# EAGLE schematic waves_v10 (EAGLE 9.6.2)

## Sheet 1 of 2
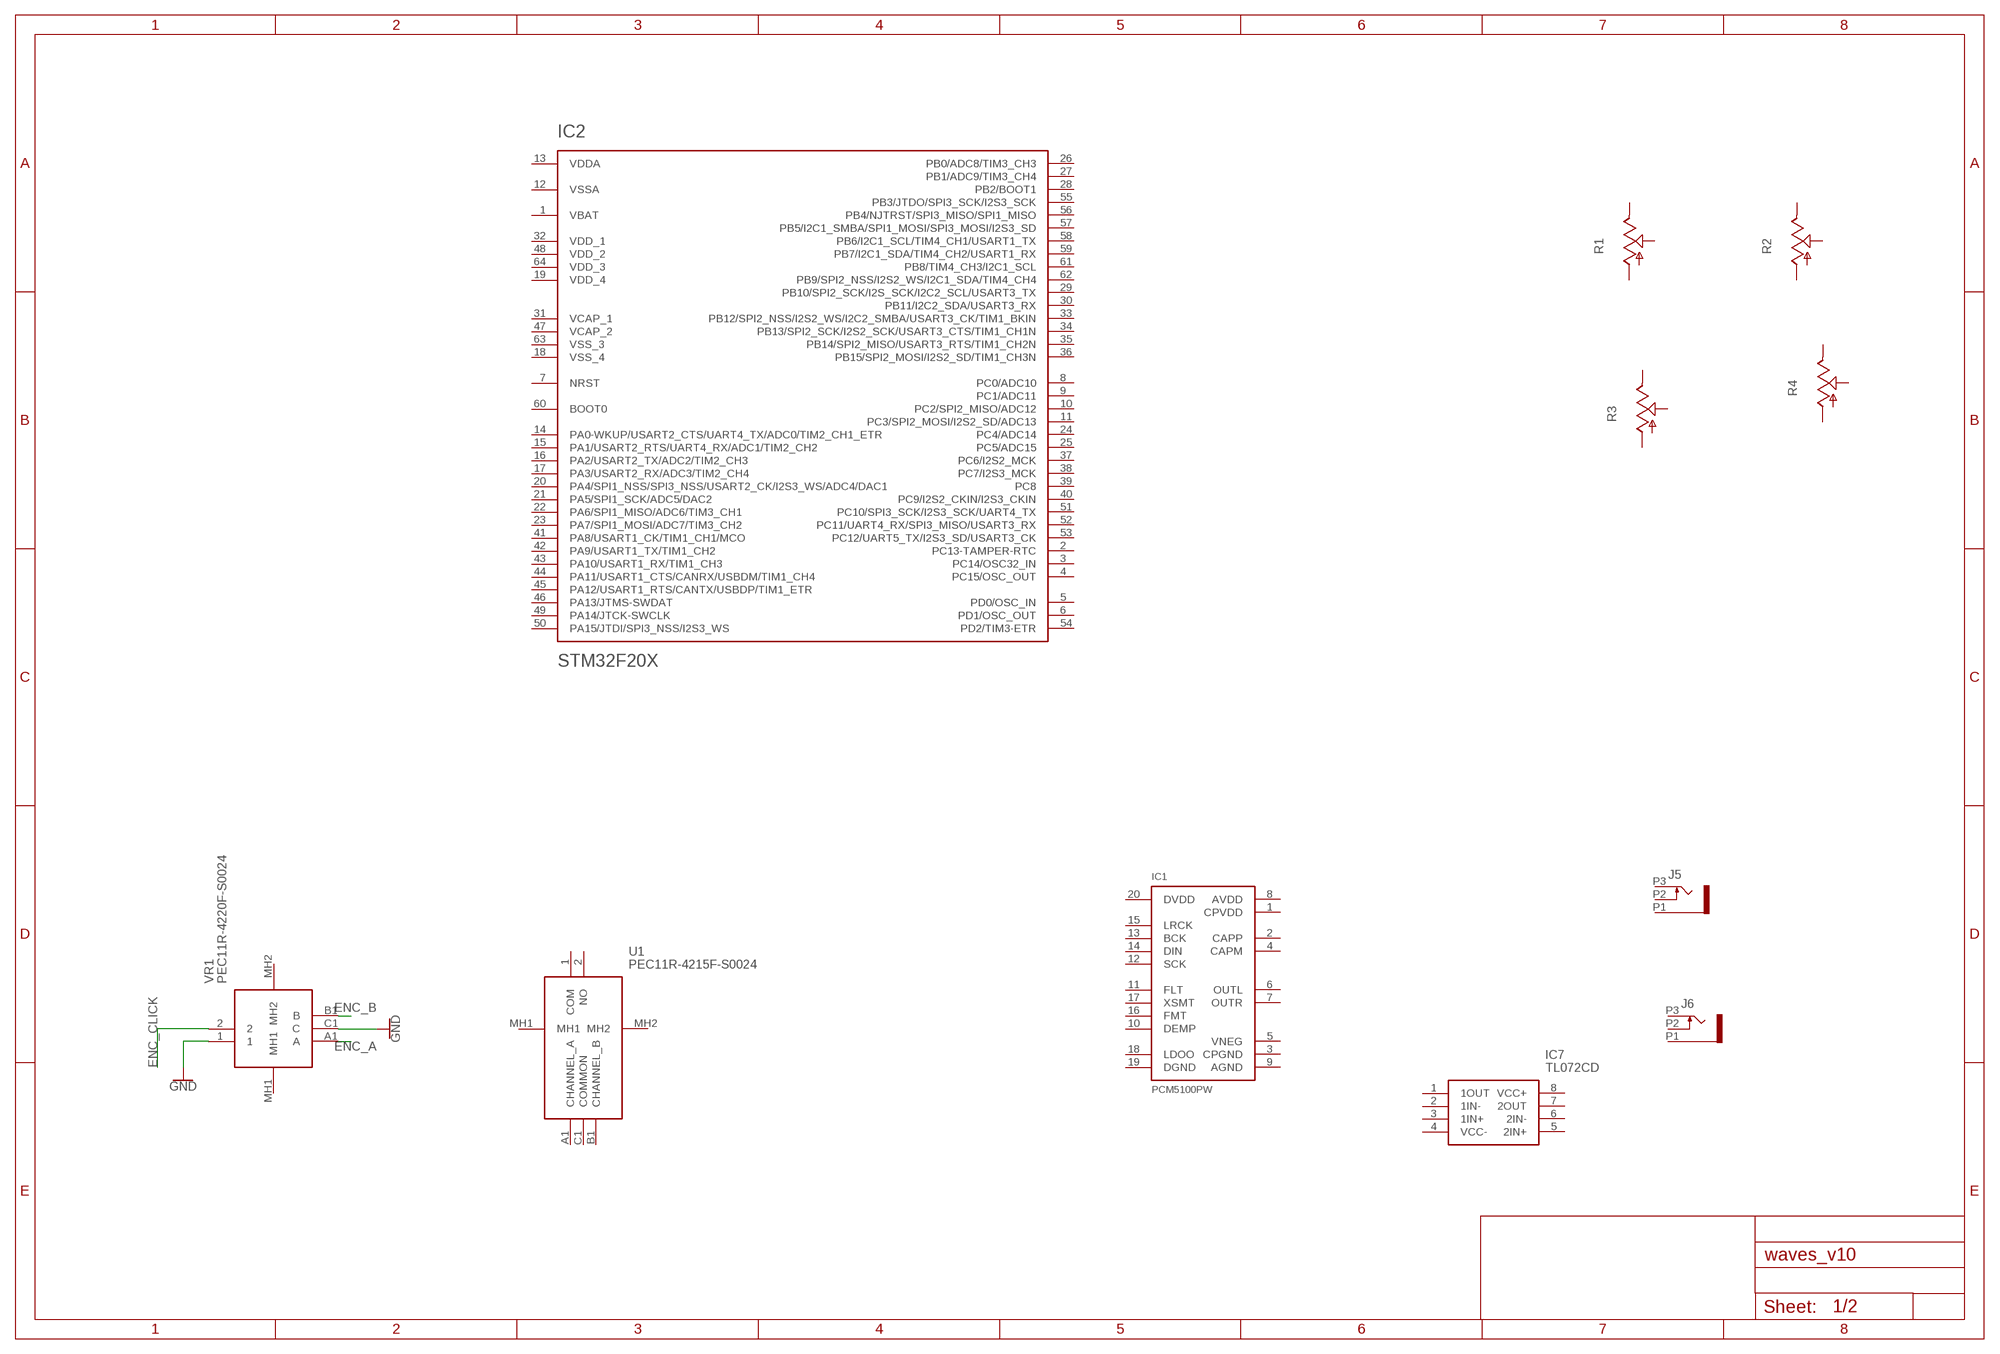
[diagram p0: schematic, sheet 1]

### Parts
IC1  PCM5100PW  [SSOP20]
IC2  STM32F20X  [TQFP-10X10-64]
IC7  TL072CD  [SOIC127P600X175-8N]
J5  PJ301_THONKICONN6  [WQP_PJ_301M6]
J6  PJ301_THONKICONN6  [WQP_PJ_301M6]
R1  POT_USVERTICAL_PS  [ALPS_POT_VERTICAL_PS]
R2  POT_USVERTICAL_PS  [ALPS_POT_VERTICAL_PS]
R3  POT_USVERTICAL_PS  [ALPS_POT_VERTICAL_PS]
R4  POT_USVERTICAL_PS  [ALPS_POT_VERTICAL_PS]
U1  PEC11R-4215F-S0024  [PEC11R4215FS0024]
VR1  PEC11R-4220F-S0024  [PEC11R4220FS0024]

### Nets
ENC_A: VR1.A1(A)
ENC_B: VR1.B1(B)
ENC_CLICK: VR1.2
GND: VR1.1 VR1.C1(C)
Unconnected: IC1.1(CPVDD) IC1.2(CAPP) IC1.3(CPGND) IC1.4(CAPM) IC1.5(VNEG) IC1.6(OUTL) IC1.7(OUTR) IC1.8(AVDD) IC1.9(AGND) IC1.10(DEMP) IC1.11(FLT) IC1.12(SCK) IC1.13(BCK) IC1.14(DIN) IC1.15(LRCK) IC1.16(FMT) IC1.17(XSMT) IC1.18(LDOO) IC1.19(DGND) IC1.20(DVDD) IC2.2(PC13-TAMPER-RTC) IC2.3(PC14/OSC32_IN) IC2.4(PC15/OSC_OUT) IC2.5(PD0/OSC_IN) IC2.6(PD1/OSC_OUT) IC2.7(NRST) IC2.8(PC0/ADC10) IC2.9(PC1/ADC11) IC2.10(PC2/SPI2_MISO/ADC12) IC2.11(PC3/SPI2_MOSI/I2S2_SD/ADC13) IC2.14(PA0-WKUP/USART2_CTS/UART4_TX/ADC0/TIM2_CH1_ETR) IC2.15(PA1/USART2_RTS/UART4_RX/ADC1/TIM2_CH2) IC2.16(PA2/USART2_TX/ADC2/TIM2_CH3) IC2.17(PA3/USART2_RX/ADC3/TIM2_CH4) IC2.20(PA4/SPI1_NSS/SPI3_NSS/USART2_CK/I2S3_WS/ADC4/DAC1) IC2.21(PA5/SPI1_SCK/ADC5/DAC2) IC2.22(PA6/SPI1_MISO/ADC6/TIM3_CH1) IC2.23(PA7/SPI1_MOSI/ADC7/TIM3_CH2) IC2.24(PC4/ADC14) IC2.25(PC5/ADC15) IC2.26(PB0/ADC8/TIM3_CH3) IC2.27(PB1/ADC9/TIM3_CH4) IC2.28(PB2/BOOT1) IC2.29(PB10/SPI2_SCK/I2S_SCK/I2C2_SCL/USART3_TX) IC2.30(PB11/I2C2_SDA/USART3_RX) IC2.33(PB12/SPI2_NSS/I2S2_WS/I2C2_SMBA/USART3_CK/TIM1_BKIN) IC2.34(PB13/SPI2_SCK/I2S2_SCK/USART3_CTS/TIM1_CH1N) IC2.35(PB14/SPI2_MISO/USART3_RTS/TIM1_CH2N) IC2.36(PB15/SPI2_MOSI/I2S2_SD/TIM1_CH3N) IC2.37(PC6/I2S2_MCK) IC2.38(PC7/I2S3_MCK) IC2.39(PC8) IC2.40(PC9/I2S2_CKIN/I2S3_CKIN) IC2.41(PA8/USART1_CK/TIM1_CH1/MCO) IC2.42(PA9/USART1_TX/TIM1_CH2) IC2.43(PA10/USART1_RX/TIM1_CH3) IC2.44(PA11/USART1_CTS/CANRX/USBDM/TIM1_CH4) IC2.45(PA12/USART1_RTS/CANTX/USBDP/TIM1_ETR) IC2.46(PA13/JTMS-SWDAT) IC2.49(PA14/JTCK-SWCLK) IC2.50(PA15/JTDI/SPI3_NSS/I2S3_WS) IC2.51(PC10/SPI3_SCK/I2S3_SCK/UART4_TX) IC2.52(PC11/UART4_RX/SPI3_MISO/USART3_RX) IC2.53(PC12/UART5_TX/I2S3_SD/USART3_CK) IC2.54(PD2/TIM3-ETR) IC2.55(PB3/JTDO/SPI3_SCK/I2S3_SCK) IC2.56(PB4/NJTRST/SPI3_MISO/SPI1_MISO) IC2.57(PB5/I2C1_SMBA/SPI1_MOSI/SPI3_MOSI/I2S3_SD) IC2.58(PB6/I2C1_SCL/TIM4_CH1/USART1_TX) IC2.59(PB7/I2C1_SDA/TIM4_CH2/USART1_RX) IC2.60(BOOT0) IC2.61(PB8/TIM4_CH3/I2C1_SCL) IC2.62(PB9/SPI2_NSS/I2S2_WS/I2C1_SDA/TIM4_CH4) IC7.1(1OUT) IC7.2(1IN-) IC7.3(1IN+) IC7.4(VCC-) IC7.5(2IN+) IC7.6(2IN-) IC7.7(2OUT) IC7.8(VCC+) J5.P1 J5.P2 J5.P3 J6.P1 J6.P2 J6.P3 R1.P$1(E) R1.P$2(S) R1.P$3(A) R2.P$1(E) R2.P$2(S) R2.P$3(A) R3.P$1(E) R3.P$2(S) R3.P$3(A) R4.P$1(E) R4.P$2(S) R4.P$3(A) U1.1(COM) U1.2(NO) U1.A1(CHANNEL_A) U1.B1(CHANNEL_B) U1.C1(COMMON) U1.MH1 U1.MH2 VR1.MH1 VR1.MH2

## Sheet 2 of 2
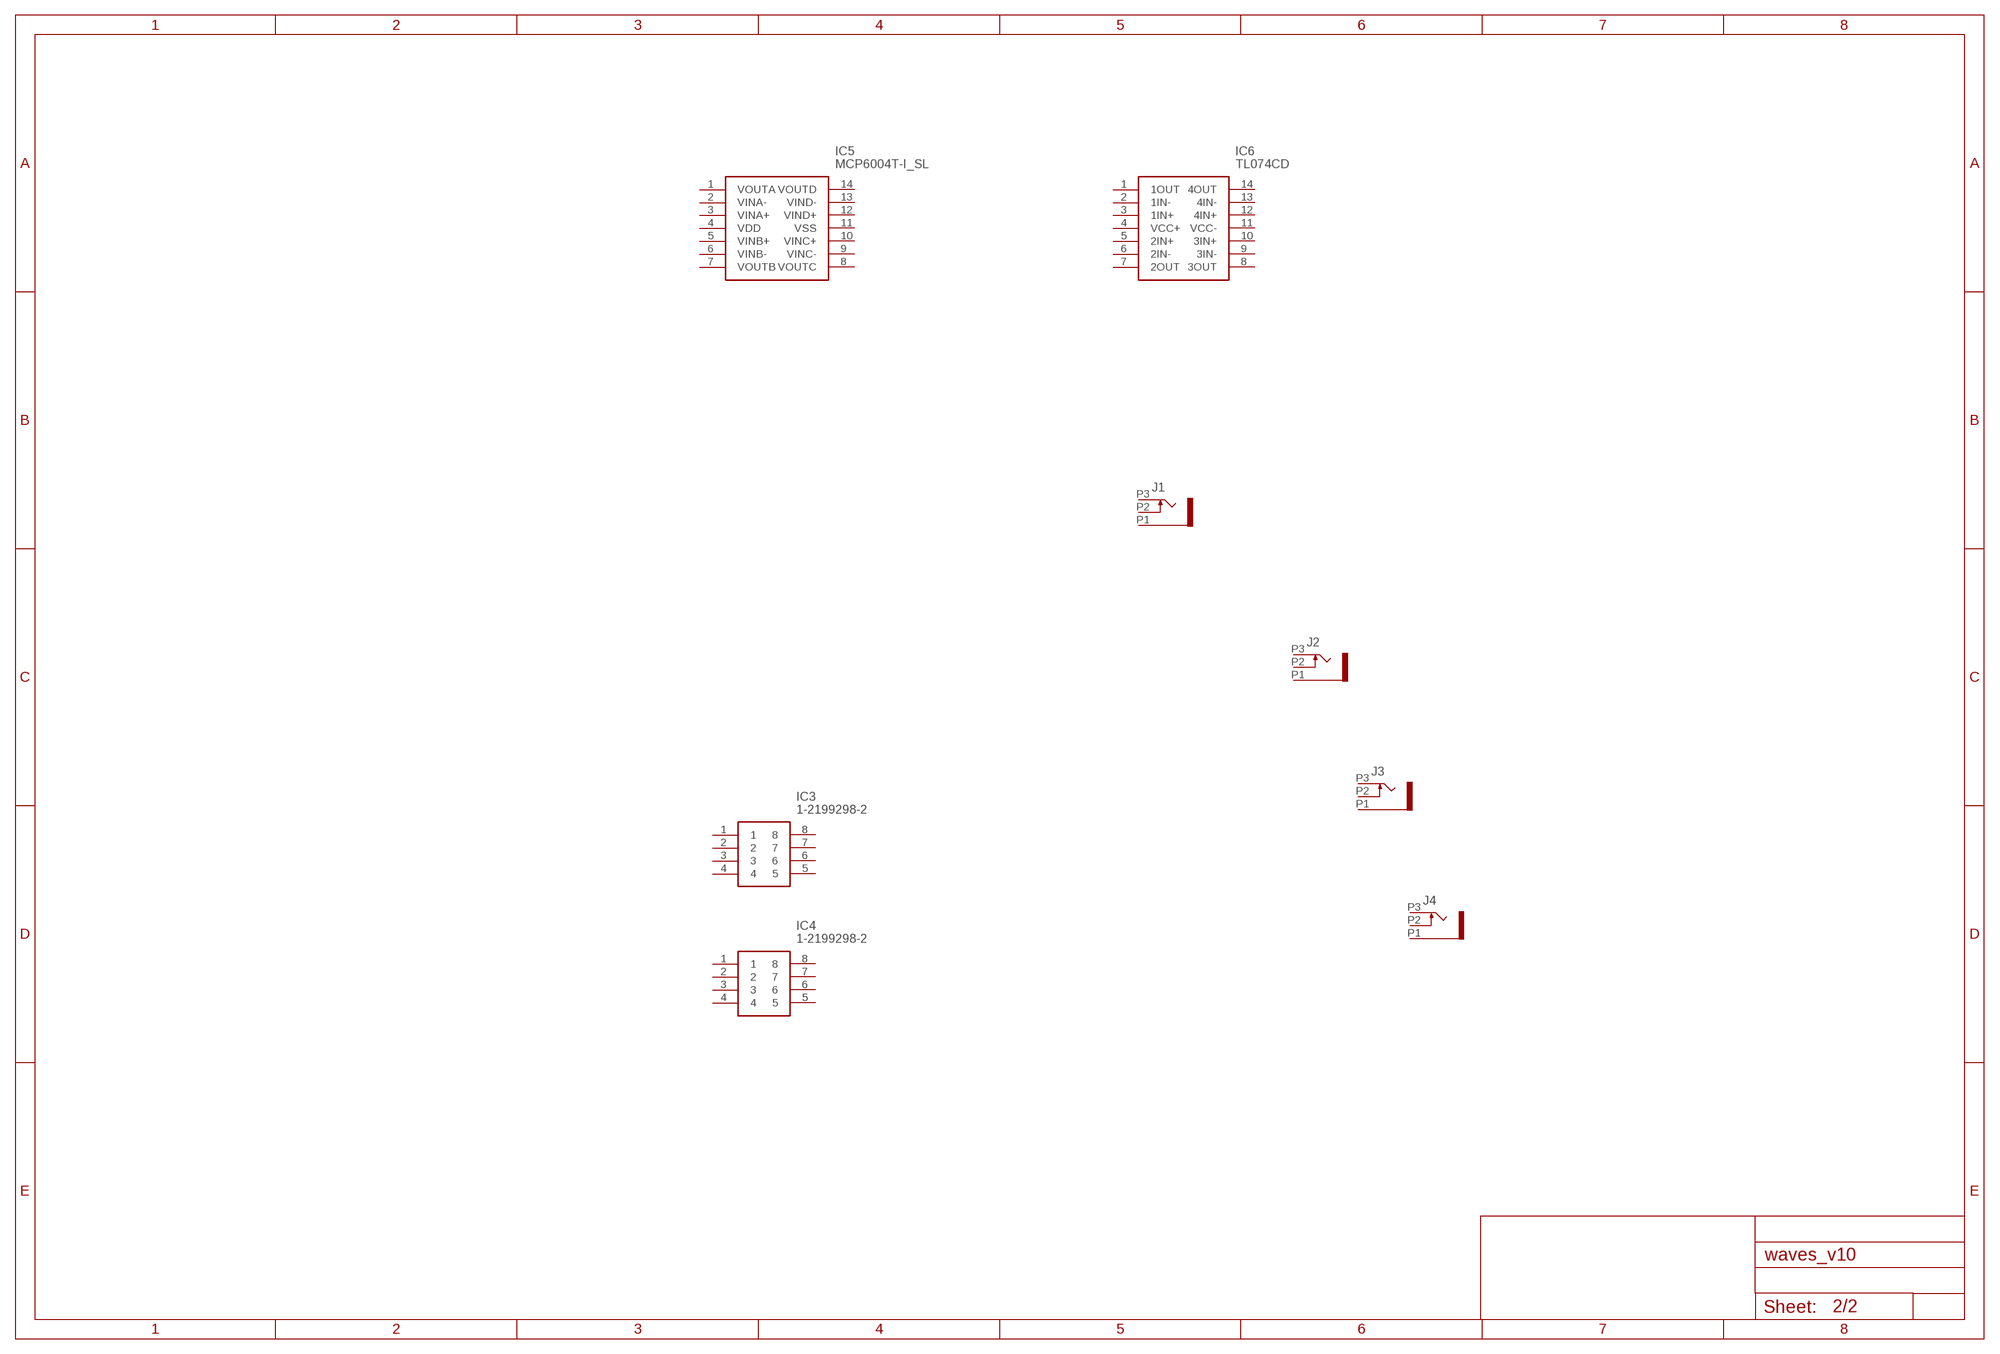
[diagram p1: schematic, sheet 2]

### Parts
IC3  1-2199298-2  [DIPS762W70P254L1016H510Q8N]
IC4  1-2199298-2  [DIPS762W70P254L1016H510Q8N]
IC5  MCP6004T-I_SL  [SOIC127P600X175-14N]
IC6  TL074CD  [SOIC127P600X175-14N]
J1  PJ301_THONKICONN6  [WQP_PJ_301M6]
J2  PJ301_THONKICONN6  [WQP_PJ_301M6]
J3  PJ301_THONKICONN6  [WQP_PJ_301M6]
J4  PJ301_THONKICONN6  [WQP_PJ_301M6]
Unconnected: IC3.1 IC3.2 IC3.3 IC3.4 IC3.5 IC3.6 IC3.7 IC3.8 IC4.1 IC4.2 IC4.3 IC4.4 IC4.5 IC4.6 IC4.7 IC4.8 IC5.1(VOUTA) IC5.2(VINA-) IC5.3(VINA+) IC5.4(VDD) IC5.5(VINB+) IC5.6(VINB-) IC5.7(VOUTB) IC5.8(VOUTC) IC5.9(VINC-) IC5.10(VINC+) IC5.11(VSS) IC5.12(VIND+) IC5.13(VIND-) IC5.14(VOUTD) IC6.1(1OUT) IC6.2(1IN-) IC6.3(1IN+) IC6.4(VCC+) IC6.5(2IN+) IC6.6(2IN-) IC6.7(2OUT) IC6.8(3OUT) IC6.9(3IN-) IC6.10(3IN+) IC6.11(VCC-) IC6.12(4IN+) IC6.13(4IN-) IC6.14(4OUT) J1.P1 J1.P2 J1.P3 J2.P1 J2.P2 J2.P3 J3.P1 J3.P2 J3.P3 J4.P1 J4.P2 J4.P3

## Power pins joined to a net without a drawn wire
VBAT: IC2.1(VBAT)
VCAP_1: IC2.31(VCAP_1)
VCAP_2: IC2.47(VCAP_2)
VDD_1: IC2.32(VDD_1)
VDD_2: IC2.48(VDD_2)
VDD_3: IC2.64(VDD_3)
VDD_4: IC2.19(VDD_4)
VDDA: IC2.13(VDDA)
VSS_3: IC2.63(VSS_3)
VSS_4: IC2.18(VSS_4)
VSSA: IC2.12(VSSA)

## Library data of the parts
IC1 = og-dac:PCM5100
IC2 = marbles_v70:STM32F20X
IC3 IC4 = 1-2199298-2:1-2199298-2: TE CONNECTIVITY - 1-2199298-2 - IC SOCKET, DIP, 8POS, TH Source: Datasheet <https://componentsearchengine.com/Datasheets/2/1-2199298-2.pdf>; DESCRIPTION: TE CONNECTIVITY - 1-2199298-2 - IC SOCKET, DIP, 8POS, TH; HEIGHT: 5.1mm; MANUFACTURER_NAME: TE Connectivity; MANUFACTURER_PART_NUMBER: 1-2199298-2; MOUSER_PART_NUMBER: 571-1-2199298-2; MOUSER_PRICE-STOCK: https://www.mouser.co.uk/ProductDetail/TE-Connectivity/1-2199298-2?qs=fK8dlpkaUMtEKa4wabwOXQ%3D%3D
IC5 = MCP6004T-I_SL:MCP6004T-I_SL: IC OPAMP QUAD 1.8V Source: Datasheet <https://datasheet.datasheetarchive.com/originals/distributors/Datasheets-DGA24/1612149.pdf>; DESCRIPTION: IC OPAMP QUAD 1.8V; HEIGHT: 1.75mm; MANUFACTURER_NAME: Microchip; MANUFACTURER_PART_NUMBER: MCP6004T-I/SL; MOUSER_PART_NUMBER: 579-MCP6004T-I/SL; MOUSER_PRICE-STOCK: https://www.mouser.co.uk/ProductDetail/Microchip-Technology/MCP6004T-I-SL?qs=Q%2Fw7XRh99ikP9NT9semfTQ%3D%3D
IC6 = TL074CD:TL074CD: Quad Low-Noise JFET-Input General-Purpose Operational Amplifier Source: Datasheet <http://www.ti.com/lit/ds/symlink/tl074.pdf>; DESCRIPTION: Quad Low-Noise JFET-Input General-Purpose Operational Amplifier; HEIGHT: 1.75mm; MANUFACTURER_NAME: Texas Instruments; MANUFACTURER_PART_NUMBER: TL074CD; MOUSER_PART_NUMBER: 595-TL074CD; MOUSER_PRICE-STOCK: https://www.mouser.co.uk/ProductDetail/Texas-Instruments/TL074CD?qs=fvkeCqCHl3BAghxamX7CPA%3D%3D
IC7 = TL072CD:TL072CD: Dual Low-Noise JFET-Input General-Purpose Operational Amplifier Source: Datasheet <http://www.ti.com/lit/ds/symlink/tl072.pdf>; DESCRIPTION: Dual Low-Noise JFET-Input General-Purpose Operational Amplifier; HEIGHT: 1.75mm; MANUFACTURER_NAME: Texas Instruments; MANUFACTURER_PART_NUMBER: TL072CD; MOUSER_PART_NUMBER: 595-TL072CD; MOUSER_PRICE-STOCK: https://www.mouser.co.uk/ProductDetail/Texas-Instruments/TL072CD?qs=5nGYs9Do7G0niDPig1J2Tw%3D%3D
J1-J6 = og-pj301:PJ301_THONKICONN: pj301 thonkiconn
R1-R4 = og-pots:POT_US
U1 = PEC11R-4215F-S0024:PEC11R-4215F-S0024: Rotary Encoder Mechanical 24 Quadrature (Incremental) Vertical 15mm SHAFT w/SWITCH Source: Datasheet <https://www.bourns.com/docs/product-datasheets/pec11r.pdf?sfvrsn=bb617cbf_12>; DESCRIPTION: Rotary Encoder Mechanical 24 Quadrature (Incremental) Vertical 15mm SHAFT w/SWITCH; HEIGHT: 21.5mm; MANUFACTURER_NAME: Bourns; MANUFACTURER_PART_NUMBER: PEC11R-4215F-S0024; MOUSER_PART_NUMBER: 652-PEC11R-4215F-S24; MOUSER_PRICE-STOCK: https://www.mouser.co.uk/ProductDetail/Bourns/PEC11R-4215F-S0024?qs=Zq5ylnUbLm5lAqmKF80wzQ%3D%3D
VR1 = PEC11R-4220F-S0024:PEC11R-4220F-S0024: Bourns 24 Pulse Incremental Mechanical Rotary Encoder with a 6 mm Flat Shaft (Not Indexed), Through Hole Source: Datasheet <https://www.bourns.com/docs/Product-Datasheets/PEC11R.pdf>; DESCRIPTION: Bourns 24 Pulse Incremental Mechanical Rotary Encoder with a 6 mm Flat Shaft (Not Indexed), Through Hole; HEIGHT: 27.5mm; MANUFACTURER_NAME: Bourns; MANUFACTURER_PART_NUMBER: PEC11R-4220F-S0024; MOUSER_PART_NUMBER: 652-PEC11R-4220F-S24; MOUSER_PRICE-STOCK: https://www.mouser.co.uk/ProductDetail/Bourns/PEC11R-4220F-S0024?qs=Zq5ylnUbLm6NGsQdib%2Ffbw%3D%3D